# Altium schematic sheet P09_F28379D-IO2.SchDoc
size 301 x 239 mm
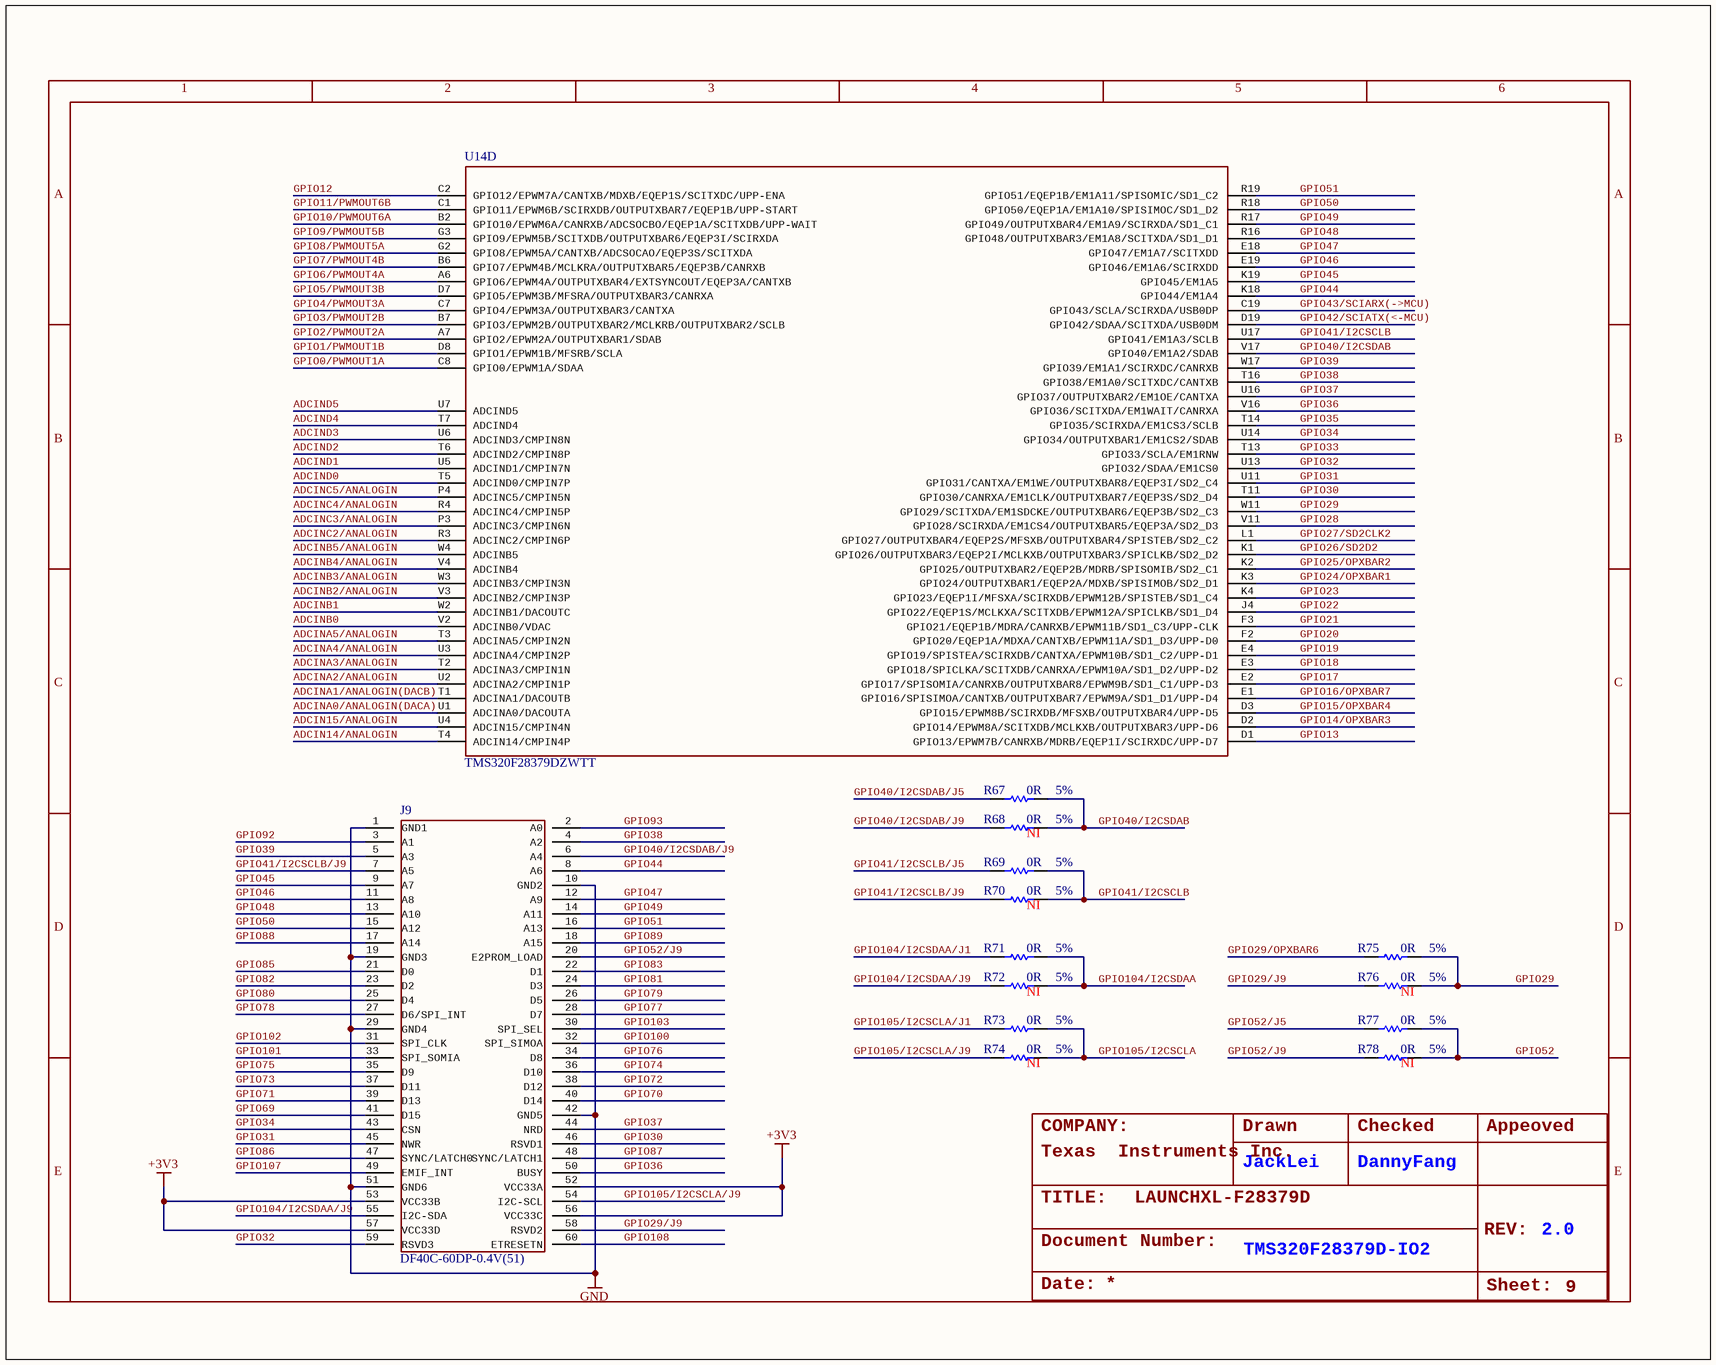
[diagram p0: P09_F28379D-IO2.SchDoc]

## Parts
J9  DF40C-60DP-0.4V(51)  [BTB60P40_2X30_1152X297X114P]
R67  Rating: 5%  [R0603]  (hidden comment: 0R)
R68  Rating: 5%  ASSY: NI  [R0603]  (hidden comment: 0R)
R69  Rating: 5%  [R0603]  (hidden comment: 0R)
R70  Rating: 5%  ASSY: NI  [R0603]  (hidden comment: 0R)
R71  Rating: 5%  [R0603]  (hidden comment: 0R)
R72  Rating: 5%  ASSY: NI  [R0603]  (hidden comment: 0R)
R73  Rating: 5%  [R0603]  (hidden comment: 0R)
R74  Rating: 5%  ASSY: NI  [R0603]  (hidden comment: 0R)
R75  Rating: 5%  [R0603]  (hidden comment: 0R)
R76  Rating: 5%  ASSY: NI  [R0603]  (hidden comment: 0R)
R77  Rating: 5%  [R0603]  (hidden comment: 0R)
R78  Rating: 5%  ASSY: NI  [R0603]  (hidden comment: 0R)
U14  TMS320F28379DZWTT  [BGA337C80P19X19_1600X1600X140]  (part D of 5)

## Nets
+3V3: J9.52(VCC33A) J9.53(VCC33B) J9.56(VCC33C) J9.57(VCC33D)
GND: J9.1(GND1) J9.10(GND2) J9.19(GND3) J9.29(GND4) J9.42(GND5) J9.51(GND6)
ADCIN14/ANALOGIN: U14.T4(ADCIN14/CMPIN4P)
ADCIN15/ANALOGIN: U14.U4(ADCIN15/CMPIN4N)
ADCINA0/ANALOGIN(DACA): U14.U1(ADCINA0/DACOUTA)
ADCINA1/ANALOGIN(DACB): U14.T1(ADCINA1/DACOUTB)
ADCINA2/ANALOGIN: U14.U2(ADCINA2/CMPIN1P)
ADCINA3/ANALOGIN: U14.T2(ADCINA3/CMPIN1N)
ADCINA4/ANALOGIN: U14.U3(ADCINA4/CMPIN2P)
ADCINA5/ANALOGIN: U14.T3(ADCINA5/CMPIN2N)
ADCINB0: U14.V2(ADCINB0/VDAC)
ADCINB1: U14.W2(ADCINB1/DACOUTC)
ADCINB2/ANALOGIN: U14.V3(ADCINB2/CMPIN3P)
ADCINB3/ANALOGIN: U14.W3(ADCINB3/CMPIN3N)
ADCINB4/ANALOGIN: U14.V4(ADCINB4)
ADCINB5/ANALOGIN: U14.W4(ADCINB5)
ADCINC2/ANALOGIN: U14.R3(ADCINC2/CMPIN6P)
ADCINC3/ANALOGIN: U14.P3(ADCINC3/CMPIN6N)
ADCINC4/ANALOGIN: U14.R4(ADCINC4/CMPIN5P)
ADCINC5/ANALOGIN: U14.P4(ADCINC5/CMPIN5N)
ADCIND0: U14.T5(ADCIND0/CMPIN7P)
ADCIND1: U14.U5(ADCIND1/CMPIN7N)
ADCIND2: U14.T6(ADCIND2/CMPIN8P)
ADCIND3: U14.U6(ADCIND3/CMPIN8N)
ADCIND4: U14.T7(ADCIND4)
ADCIND5: U14.U7(ADCIND5)
GPIO0/PWMOUT1A: U14.C8(GPIO0/EPWM1A/SDAA)
GPIO1/PWMOUT1B: U14.D8(GPIO1/EPWM1B/MFSRB/SCLA)
GPIO2/PWMOUT2A: U14.A7(GPIO2/EPWM2A/OUTPUTXBAR1/SDAB)
GPIO3/PWMOUT2B: U14.B7(GPIO3/EPWM2B/OUTPUTXBAR2/MCLKRB/OUTPUTXBAR2/SCLB)
GPIO4/PWMOUT3A: U14.C7(GPIO4/EPWM3A/OUTPUTXBAR3/CANTXA)
GPIO5/PWMOUT3B: U14.D7(GPIO5/EPWM3B/MFSRA/OUTPUTXBAR3/CANRXA)
GPIO6/PWMOUT4A: U14.A6(GPIO6/EPWM4A/OUTPUTXBAR4/EXTSYNCOUT/EQEP3A/CANTXB)
GPIO7/PWMOUT4B: U14.B6(GPIO7/EPWM4B/MCLKRA/OUTPUTXBAR5/EQEP3B/CANRXB)
GPIO8/PWMOUT5A: U14.G2(GPIO8/EPWM5A/CANTXB/ADCSOCAO/EQEP3S/SCITXDA)
GPIO9/PWMOUT5B: U14.G3(GPIO9/EPWM5B/SCITXDB/OUTPUTXBAR6/EQEP3I/SCIRXDA)
GPIO10/PWMOUT6A: U14.B2(GPIO10/EPWM6A/CANRXB/ADCSOCBO/EQEP1A/SCITXDB/UPP-WAIT)
GPIO11/PWMOUT6B: U14.C1(GPIO11/EPWM6B/SCIRXDB/OUTPUTXBAR7/EQEP1B/UPP-START)
GPIO12: U14.C2(GPIO12/EPWM7A/CANTXB/MDXB/EQEP1S/SCITXDC/UPP-ENA)
GPIO13: U14.D1(GPIO13/EPWM7B/CANRXB/MDRB/EQEP1I/SCIRXDC/UPP-D7)
GPIO14/OPXBAR3: U14.D2(GPIO14/EPWM8A/SCITXDB/MCLKXB/OUTPUTXBAR3/UPP-D6)
GPIO15/OPXBAR4: U14.D3(GPIO15/EPWM8B/SCIRXDB/MFSXB/OUTPUTXBAR4/UPP-D5)
GPIO16/OPXBAR7: U14.E1(GPIO16/SPISIMOA/CANTXB/OUTPUTXBAR7/EPWM9A/SD1_D1/UPP-D4)
GPIO17: U14.E2(GPIO17/SPISOMIA/CANRXB/OUTPUTXBAR8/EPWM9B/SD1_C1/UPP-D3)
GPIO18: U14.E3(GPIO18/SPICLKA/SCITXDB/CANRXA/EPWM10A/SD1_D2/UPP-D2)
GPIO19: U14.E4(GPIO19/SPISTEA/SCIRXDB/CANTXA/EPWM10B/SD1_C2/UPP-D1)
GPIO20: U14.F2(GPIO20/EQEP1A/MDXA/CANTXB/EPWM11A/SD1_D3/UPP-D0)
GPIO21: U14.F3(GPIO21/EQEP1B/MDRA/CANRXB/EPWM11B/SD1_C3/UPP-CLK)
GPIO22: U14.J4(GPIO22/EQEP1S/MCLKXA/SCITXDB/EPWM12A/SPICLKB/SD1_D4)
GPIO23: U14.K4(GPIO23/EQEP1I/MFSXA/SCIRXDB/EPWM12B/SPISTEB/SD1_C4)
GPIO24/OPXBAR1: U14.K3(GPIO24/OUTPUTXBAR1/EQEP2A/MDXB/SPISIMOB/SD2_D1)
GPIO25/OPXBAR2: U14.K2(GPIO25/OUTPUTXBAR2/EQEP2B/MDRB/SPISOMIB/SD2_C1)
GPIO26/SD2D2: U14.K1(GPIO26/OUTPUTXBAR3/EQEP2I/MCLKXB/OUTPUTXBAR3/SPICLKB/SD2_D2)
GPIO27/SD2CLK2: U14.L1(GPIO27/OUTPUTXBAR4/EQEP2S/MFSXB/OUTPUTXBAR4/SPISTEB/SD2_C2)
GPIO28: U14.V11(GPIO28/SCIRXDA/EM1CS4/OUTPUTXBAR5/EQEP3A/SD2_D3)
GPIO29: R75.1 R76.1 U14.W11(GPIO29/SCITXDA/EM1SDCKE/OUTPUTXBAR6/EQEP3B/SD2_C3)
GPIO29/J9: J9.58(RSVD2) R76.2
GPIO29/OPXBAR6: R75.2
GPIO30: J9.46(RSVD1) U14.T11(GPIO30/CANRXA/EM1CLK/OUTPUTXBAR7/EQEP3S/SD2_D4)
GPIO31: J9.45(NWR) U14.U11(GPIO31/CANTXA/EM1WE/OUTPUTXBAR8/EQEP3I/SD2_C4)
GPIO32: J9.59(RSVD3) U14.U13(GPIO32/SDAA/EM1CS0)
GPIO33: U14.T13(GPIO33/SCLA/EM1RNW)
GPIO34: J9.43(CSN) U14.U14(GPIO34/OUTPUTXBAR1/EM1CS2/SDAB)
GPIO35: U14.T14(GPIO35/SCIRXDA/EM1CS3/SCLB)
GPIO36: J9.50(BUSY) U14.V16(GPIO36/SCITXDA/EM1WAIT/CANRXA)
GPIO37: J9.44(NRD) U14.U16(GPIO37/OUTPUTXBAR2/EM1OE/CANTXA)
GPIO38: J9.4(A2) U14.T16(GPIO38/EM1A0/SCITXDC/CANTXB)
GPIO39: J9.5(A3) U14.W17(GPIO39/EM1A1/SCIRXDC/CANRXB)
GPIO40/I2CSDAB: R67.1 R68.1 U14.V17(GPIO40/EM1A2/SDAB)
GPIO40/I2CSDAB/J5: R67.2
GPIO40/I2CSDAB/J9: J9.6(A4) R68.2
GPIO41/I2CSCLB: R69.1 R70.1 U14.U17(GPIO41/EM1A3/SCLB)
GPIO41/I2CSCLB/J5: R69.2
GPIO41/I2CSCLB/J9: J9.7(A5) R70.2
GPIO42/SCIATX(<-MCU): U14.D19(GPIO42/SDAA/SCITXDA/USB0DM)
GPIO43/SCIARX(->MCU): U14.C19(GPIO43/SCLA/SCIRXDA/USB0DP)
GPIO44: J9.8(A6) U14.K18(GPIO44/EM1A4)
GPIO45: J9.9(A7) U14.K19(GPIO45/EM1A5)
GPIO46: J9.11(A8) U14.E19(GPIO46/EM1A6/SCIRXDD)
GPIO47: J9.12(A9) U14.E18(GPIO47/EM1A7/SCITXDD)
GPIO48: J9.13(A10) U14.R16(GPIO48/OUTPUTXBAR3/EM1A8/SCITXDA/SD1_D1)
GPIO49: J9.14(A11) U14.R17(GPIO49/OUTPUTXBAR4/EM1A9/SCIRXDA/SD1_C1)
GPIO50: J9.15(A12) U14.R18(GPIO50/EQEP1A/EM1A10/SPISIMOC/SD1_D2)
GPIO51: J9.16(A13) U14.R19(GPIO51/EQEP1B/EM1A11/SPISOMIC/SD1_C2)
GPIO52: R77.1 R78.1
GPIO52/J5: R77.2
GPIO52/J9: J9.20(E2PROM_LOAD) R78.2
GPIO69: J9.41(D15)
GPIO70: J9.40(D14)
GPIO71: J9.39(D13)
GPIO72: J9.38(D12)
GPIO73: J9.37(D11)
GPIO74: J9.36(D10)
GPIO75: J9.35(D9)
GPIO76: J9.34(D8)
GPIO77: J9.28(D7)
GPIO78: J9.27(D6/SPI_INT)
GPIO79: J9.26(D5)
GPIO80: J9.25(D4)
GPIO81: J9.24(D3)
GPIO82: J9.23(D2)
GPIO83: J9.22(D1)
GPIO85: J9.21(D0)
GPIO86: J9.47(SYNC/LATCH0)
GPIO87: J9.48(SYNC/LATCH1)
GPIO88: J9.17(A14)
GPIO89: J9.18(A15)
GPIO92: J9.3(A1)
GPIO93: J9.2(A0)
GPIO100: J9.32(SPI_SIMOA)
GPIO101: J9.33(SPI_SOMIA)
GPIO102: J9.31(SPI_CLK)
GPIO103: J9.30(SPI_SEL)
GPIO104/I2CSDAA: R71.1 R72.1
GPIO104/I2CSDAA/J1: R71.2
GPIO104/I2CSDAA/J9: J9.55(I2C-SDA) R72.2
GPIO105/I2CSCLA: R73.1 R74.1
GPIO105/I2CSCLA/J1: R73.2
GPIO105/I2CSCLA/J9: J9.54(I2C-SCL) R74.2
GPIO107: J9.49(EMIF_INT)
GPIO108: J9.60(ETRESETN)

## Notes on the sheet
- COMPANY:
- Texas
  Instruments Inc.
- JackLei
- Drawn
- Checked
- DannyFang
- Appeoved
- TITLE:
- Document Number:
- LAUNCHXL-F28379D
- REV:
- 2.0
- Date:
- TMS320F28379D-IO2
- Sheet:
- 9
- 1
- 2
- 3
- 4
- 5
- 6
- A
- B
- C
- D
- E

## Library data of the parts
J9 = 1009015100039: CONN HDR 60POS 0.4MM SMD GOLD TR; Manufacturer: HIROSE; Embest PN: 1009015100039; Value: DF40C-60DP-0.4V(51); Part Type: BTB Connector; Manufacturer Part Number: DF40C-60DP-0.4V(51)
R67-R78 = 1003001100161: RES,0R,+/-5%,1/10W,SMD0603; Manufacturer: YAGEO; Manufacturer Part Number: RC0603JR-070RL; Embest PN: 1003001100161; Value: 0R; Part Type: Thick film Resistor
U14 = 1002002100202C: IC, MCU 32BIT 1024KB,TMS320F28379DZWTT,BGA-337,SMD,customer supply; Manufacturer: TI; Embest PN: 1002002100202C; Value: TMS320F28379DZWTT; Part Type: MCU; Manufacturer Part Number: TMS320F28379DZWTT